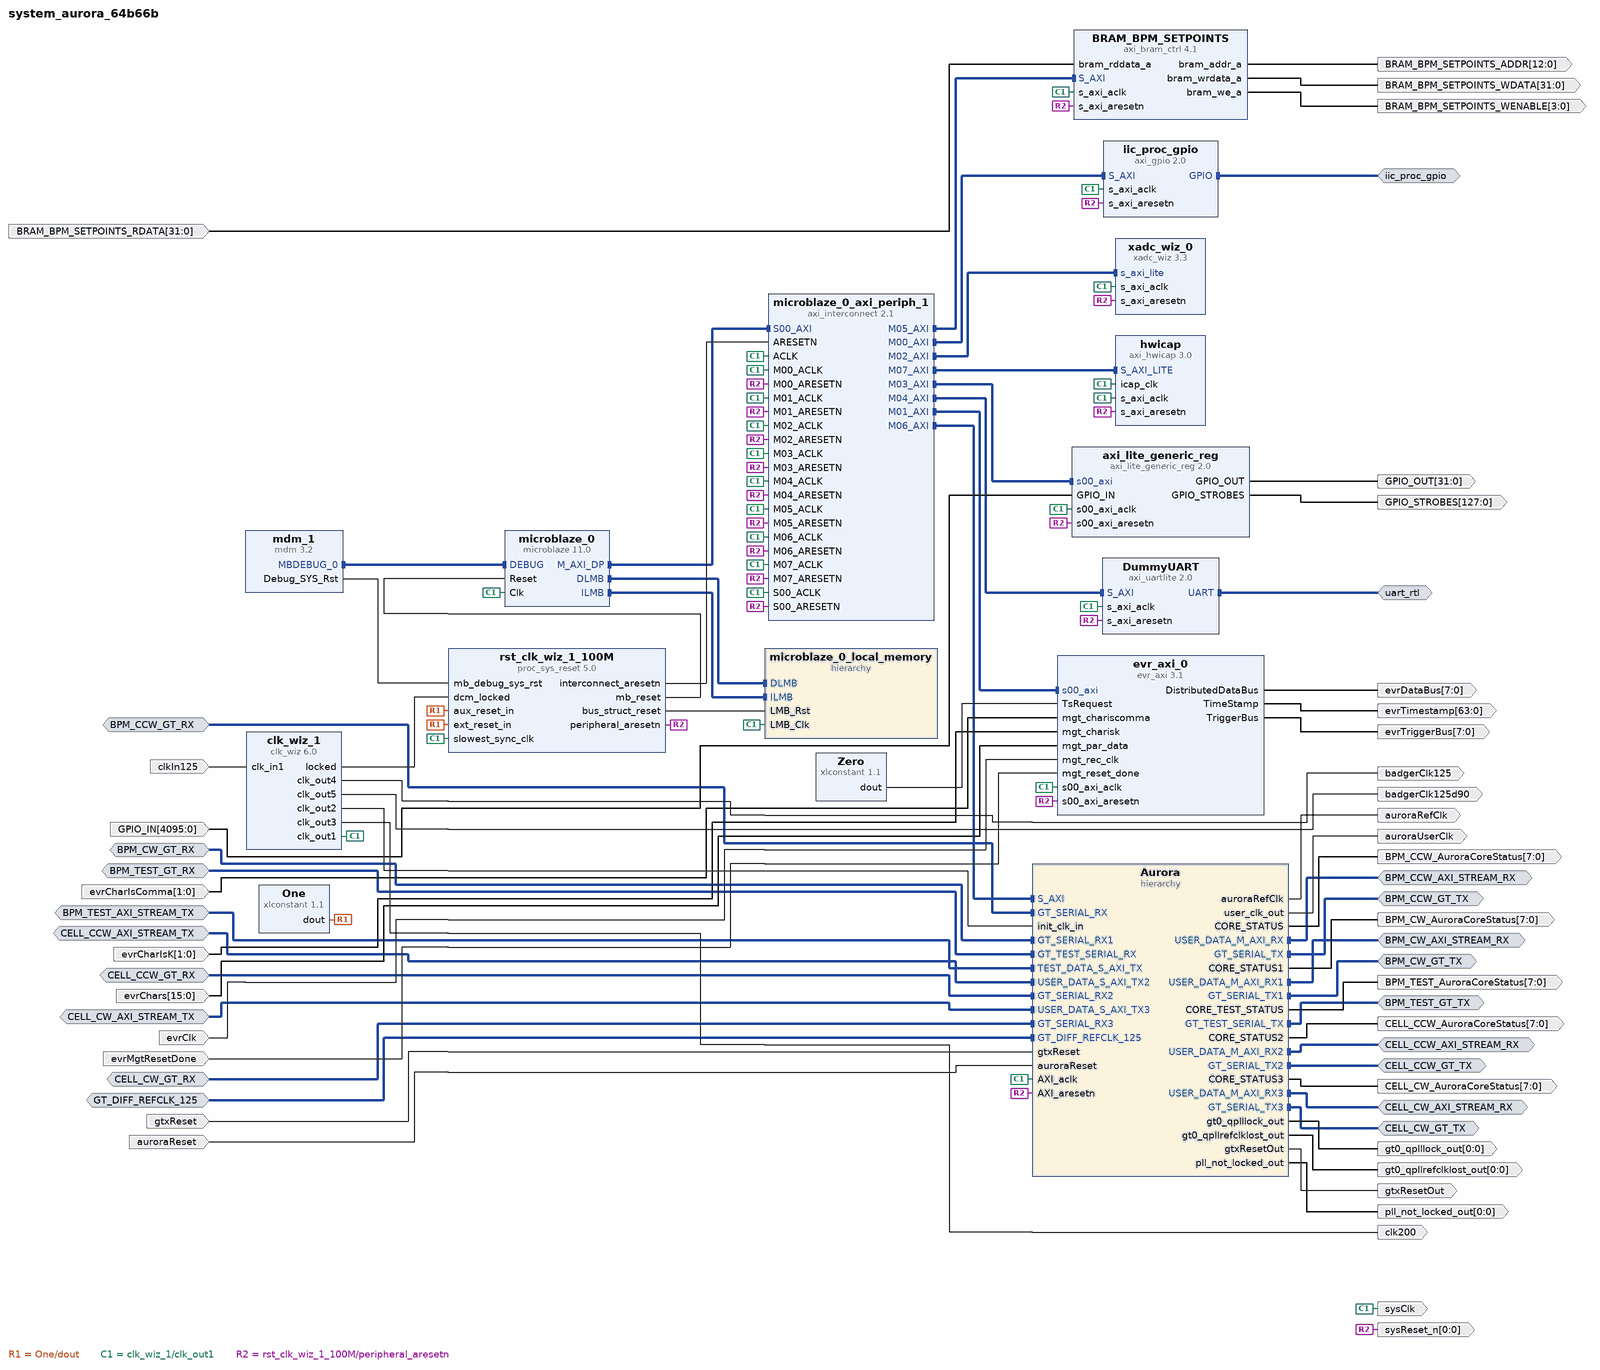
[diagram p0: block diagram of the top level]
# Vivado block design system_aurora_64b66b, xc7k160tffg676-2, Vivado 2022.1
create_bd_design system_aurora_64b66b

create_bd_intf_port -mode Slave -vlnv xilinx.com:display_aurora:GT_Serial_Transceiver_Pins_RX_rtl:1.0 BPM_CW_GT_RX
create_bd_intf_port -mode Master -vlnv xilinx.com:display_aurora:GT_Serial_Transceiver_Pins_TX_rtl:1.0 BPM_CW_GT_TX
create_bd_intf_port -mode Master -vlnv xilinx.com:display_aurora:GT_Serial_Transceiver_Pins_TX_rtl:1.0 BPM_CCW_GT_TX
create_bd_intf_port -mode Slave -vlnv xilinx.com:display_aurora:GT_Serial_Transceiver_Pins_RX_rtl:1.0 BPM_CCW_GT_RX
create_bd_intf_port -mode Slave -vlnv xilinx.com:display_aurora:GT_Serial_Transceiver_Pins_RX_rtl:1.0 CELL_CCW_GT_RX
create_bd_intf_port -mode Slave -vlnv xilinx.com:display_aurora:GT_Serial_Transceiver_Pins_RX_rtl:1.0 CELL_CW_GT_RX
create_bd_intf_port -mode Slave -vlnv xilinx.com:interface:axis_rtl:1.0 CELL_CCW_AXI_STREAM_TX
set_property -dict [list \
  CONFIG.HAS_TKEEP 0 \
  CONFIG.HAS_TLAST 0 \
  CONFIG.HAS_TREADY 1 \
  CONFIG.HAS_TSTRB 0 \
  CONFIG.LAYERED_METADATA undef \
  CONFIG.TDATA_NUM_BYTES 4 \
  CONFIG.TDEST_WIDTH 0 \
  CONFIG.TID_WIDTH 0 \
  CONFIG.TUSER_WIDTH 0 \
] [get_bd_intf_ports CELL_CCW_AXI_STREAM_TX]
create_bd_intf_port -mode Slave -vlnv xilinx.com:interface:axis_rtl:1.0 CELL_CW_AXI_STREAM_TX
set_property -dict [list \
  CONFIG.HAS_TKEEP 0 \
  CONFIG.HAS_TLAST 0 \
  CONFIG.HAS_TREADY 1 \
  CONFIG.HAS_TSTRB 0 \
  CONFIG.LAYERED_METADATA undef \
  CONFIG.TDATA_NUM_BYTES 4 \
  CONFIG.TDEST_WIDTH 0 \
  CONFIG.TID_WIDTH 0 \
  CONFIG.TUSER_WIDTH 0 \
] [get_bd_intf_ports CELL_CW_AXI_STREAM_TX]
create_bd_intf_port -mode Master -vlnv xilinx.com:display_aurora:GT_Serial_Transceiver_Pins_TX_rtl:1.0 CELL_CCW_GT_TX
create_bd_intf_port -mode Master -vlnv xilinx.com:display_aurora:GT_Serial_Transceiver_Pins_TX_rtl:1.0 CELL_CW_GT_TX
create_bd_intf_port -mode Master -vlnv xilinx.com:interface:axis_rtl:1.0 BPM_CW_AXI_STREAM_RX
create_bd_intf_port -mode Master -vlnv xilinx.com:interface:axis_rtl:1.0 CELL_CCW_AXI_STREAM_RX
create_bd_intf_port -mode Master -vlnv xilinx.com:interface:axis_rtl:1.0 CELL_CW_AXI_STREAM_RX
create_bd_intf_port -mode Master -vlnv xilinx.com:interface:axis_rtl:1.0 BPM_CCW_AXI_STREAM_RX
create_bd_intf_port -mode Master -vlnv xilinx.com:interface:uart_rtl:1.0 uart_rtl
create_bd_intf_port -mode Slave -vlnv xilinx.com:interface:diff_clock_rtl:1.0 GT_DIFF_REFCLK_125
set_property -dict {CONFIG.FREQ_HZ 125000000} [get_bd_intf_ports GT_DIFF_REFCLK_125]
create_bd_intf_port -mode Master -vlnv xilinx.com:interface:gpio_rtl:1.0 iic_proc_gpio
create_bd_intf_port -mode Slave -vlnv xilinx.com:interface:axis_rtl:1.0 BPM_TEST_AXI_STREAM_TX
set_property -dict [list \
  CONFIG.HAS_TKEEP 0 \
  CONFIG.HAS_TLAST 0 \
  CONFIG.HAS_TREADY 1 \
  CONFIG.HAS_TSTRB 0 \
  CONFIG.LAYERED_METADATA undef \
  CONFIG.TDATA_NUM_BYTES 4 \
  CONFIG.TDEST_WIDTH 0 \
  CONFIG.TID_WIDTH 0 \
  CONFIG.TUSER_WIDTH 0 \
] [get_bd_intf_ports BPM_TEST_AXI_STREAM_TX]
create_bd_intf_port -mode Master -vlnv xilinx.com:display_aurora:GT_Serial_Transceiver_Pins_TX_rtl:1.0 BPM_TEST_GT_TX
create_bd_intf_port -mode Slave -vlnv xilinx.com:display_aurora:GT_Serial_Transceiver_Pins_RX_rtl:1.0 BPM_TEST_GT_RX
create_bd_port -dir O -type clk sysClk
create_bd_port -dir O -from 0 -to 0 sysReset_n
create_bd_port -dir I -type clk clkIn125
set_property -dict {CONFIG.FREQ_HZ 125000000 CONFIG.PHASE 0.000} [get_bd_ports clkIn125]
create_bd_port -dir O -type clk auroraUserClk
set_property -dict [list \
  CONFIG.ASSOCIATED_BUSIF BPM_CCW_AXI_STREAM_RX:BPM_CW_AXI_STREAM_RX:CELL_CCW_AXI_STREAM_RX:CELL_CW_AXI_STREAM_RX:CELL_CCW_AXI_STREAM_TX:CELL_CW_AXI_STREAM_TX:BPM_TEST_AXI_STREAM_TX \
  CONFIG.ASSOCIATED_RESET auroraReset_CELL_CCW:auroraReset_BPM_CW:gtxReset_BPM_CW:auroraReset_CELL_CW:gtxReset_CELL_CW:auroraReset:auroraReset_AXI:gtxReset:gtxReset_CELL_CCW \
] [get_bd_ports auroraUserClk]
create_bd_port -dir O -from 0 -to 0 gt0_qpllrefclklost_out
create_bd_port -dir O -from 0 -to 0 gt0_qplllock_out
create_bd_port -dir O -from 0 -to 0 pll_not_locked_out
create_bd_port -dir O -from 7 -to 0 evrTriggerBus
create_bd_port -dir O -from 12 -to 0 BRAM_BPM_SETPOINTS_ADDR
create_bd_port -dir O -from 31 -to 0 BRAM_BPM_SETPOINTS_WDATA
create_bd_port -dir O -from 3 -to 0 BRAM_BPM_SETPOINTS_WENABLE
create_bd_port -dir I -from 31 -to 0 BRAM_BPM_SETPOINTS_RDATA
create_bd_port -dir O clk200
create_bd_port -dir O -from 7 -to 0 evrDataBus
create_bd_port -dir I evrClk
create_bd_port -dir I -from 15 -to 0 evrChars
create_bd_port -dir I -from 1 -to 0 evrCharIsComma
create_bd_port -dir I -from 1 -to 0 evrCharIsK
create_bd_port -dir I evrMgtResetDone
create_bd_port -dir O -from 63 -to 0 evrTimestamp
create_bd_port -dir I -type rst auroraReset
set_property -dict {CONFIG.POLARITY ACTIVE_HIGH} [get_bd_ports auroraReset]
create_bd_port -dir I -type rst gtxReset
set_property -dict {CONFIG.POLARITY ACTIVE_HIGH} [get_bd_ports gtxReset]
create_bd_port -dir O -type rst gtxResetOut
create_bd_port -dir O -type clk auroraRefClk
create_bd_port -dir O -from 127 -to 0 GPIO_STROBES
create_bd_port -dir O -from 31 -to 0 GPIO_OUT
create_bd_port -dir I -from 4095 -to 0 GPIO_IN
create_bd_port -dir O -type clk badgerClk125
create_bd_port -dir O -type clk badgerClk125d90
create_bd_port -dir O -from 7 -to 0 BPM_CCW_AuroraCoreStatus
create_bd_port -dir O -from 7 -to 0 BPM_CW_AuroraCoreStatus
create_bd_port -dir O -from 7 -to 0 CELL_CCW_AuroraCoreStatus
create_bd_port -dir O -from 7 -to 0 CELL_CW_AuroraCoreStatus
create_bd_port -dir O -from 7 -to 0 BPM_TEST_AuroraCoreStatus

create_bd_cell -type hier microblaze_0_local_memory
create_bd_cell -type hier Aurora
create_bd_cell -type ip -vlnv xilinx.com:ip:proc_sys_reset:5.0 rst_clk_wiz_1_100M
create_bd_cell -type ip -vlnv xilinx.com:ip:axi_bram_ctrl:4.1 BRAM_BPM_SETPOINTS
set_property -dict {CONFIG.PROTOCOL AXI4LITE CONFIG.SINGLE_PORT_BRAM 1} [get_bd_cells BRAM_BPM_SETPOINTS]
create_bd_cell -type ip -vlnv xilinx.com:ip:axi_uartlite:2.0 DummyUART
create_bd_cell -type ip -vlnv xilinx.com:ip:clk_wiz:6.0 clk_wiz_1
set_property -dict [list \
  CONFIG.CLKIN1_JITTER_PS 80.0 \
  CONFIG.CLKOUT1_JITTER 124.615 \
  CONFIG.CLKOUT1_PHASE_ERROR 96.948 \
  CONFIG.CLKOUT2_JITTER 143.688 \
  CONFIG.CLKOUT2_PHASE_ERROR 96.948 \
  CONFIG.CLKOUT2_REQUESTED_OUT_FREQ 50 \
  CONFIG.CLKOUT2_USED true \
  CONFIG.CLKOUT3_JITTER 109.241 \
  CONFIG.CLKOUT3_PHASE_ERROR 96.948 \
  CONFIG.CLKOUT3_REQUESTED_OUT_FREQ 200 \
  CONFIG.CLKOUT3_USED true \
  CONFIG.CLKOUT4_JITTER 119.348 \
  CONFIG.CLKOUT4_PHASE_ERROR 96.948 \
  CONFIG.CLKOUT4_REQUESTED_OUT_FREQ 125.000 \
  CONFIG.CLKOUT4_USED true \
  CONFIG.CLKOUT5_JITTER 119.348 \
  CONFIG.CLKOUT5_PHASE_ERROR 96.948 \
  CONFIG.CLKOUT5_REQUESTED_OUT_FREQ 125.000 \
  CONFIG.CLKOUT5_REQUESTED_PHASE 90.000 \
  CONFIG.CLKOUT5_USED true \
  CONFIG.CLKOUT6_JITTER 154.207 \
  CONFIG.CLKOUT6_PHASE_ERROR 164.985 \
  CONFIG.CLKOUT6_REQUESTED_OUT_FREQ 100.000 \
  CONFIG.CLKOUT6_USED false \
  CONFIG.MMCM_CLKFBOUT_MULT_F 8.000 \
  CONFIG.MMCM_CLKIN1_PERIOD 8.000 \
  CONFIG.MMCM_CLKIN2_PERIOD 10.000 \
  CONFIG.MMCM_CLKOUT0_DIVIDE_F 10.000 \
  CONFIG.MMCM_CLKOUT1_DIVIDE 20 \
  CONFIG.MMCM_CLKOUT2_DIVIDE 5 \
  CONFIG.MMCM_CLKOUT3_DIVIDE 8 \
  CONFIG.MMCM_CLKOUT4_DIVIDE 8 \
  CONFIG.MMCM_CLKOUT4_PHASE 90.000 \
  CONFIG.MMCM_CLKOUT5_DIVIDE 1 \
  CONFIG.MMCM_DIVCLK_DIVIDE 1 \
  CONFIG.NUM_OUT_CLKS 5 \
  CONFIG.PRIM_IN_FREQ 125.000 \
  CONFIG.PRIM_SOURCE Global_buffer \
  CONFIG.USE_RESET false \
] [get_bd_cells clk_wiz_1]
create_bd_cell -type ip -vlnv xilinx.com:ip:mdm:3.2 mdm_1
create_bd_cell -type ip -vlnv xilinx.com:ip:microblaze:11.0 microblaze_0
set_property -dict [list \
  CONFIG.C_ADDR_TAG_BITS 0 \
  CONFIG.C_DCACHE_ADDR_TAG 0 \
  CONFIG.C_DEBUG_ENABLED 1 \
  CONFIG.C_D_AXI 1 \
  CONFIG.C_D_LMB 1 \
  CONFIG.C_I_LMB 1 \
  CONFIG.C_USE_BARREL 1 \
  CONFIG.C_USE_BRANCH_TARGET_CACHE 1 \
  CONFIG.C_USE_DCACHE 0 \
  CONFIG.C_USE_DIV 1 \
  CONFIG.C_USE_FPU 0 \
  CONFIG.C_USE_HW_MUL 1 \
  CONFIG.C_USE_ICACHE 0 \
] [get_bd_cells microblaze_0]
create_bd_cell -type ip -vlnv xilinx.com:ip:axi_interconnect:2.1 microblaze_0_axi_periph_1
set_property -dict {CONFIG.NUM_MI 8 CONFIG.SYNCHRONIZATION_STAGES 2} [get_bd_cells microblaze_0_axi_periph_1]
create_bd_cell -type ip -vlnv xilinx.com:ip:xadc_wiz:3.3 xadc_wiz_0
set_property -dict [list \
  CONFIG.ADC_CONVERSION_RATE 500 \
  CONFIG.ADC_OFFSET_AND_GAIN_CALIBRATION true \
  CONFIG.ADC_OFFSET_CALIBRATION true \
  CONFIG.AVERAGE_ENABLE_TEMPERATURE true \
  CONFIG.AVERAGE_ENABLE_VBRAM true \
  CONFIG.AVERAGE_ENABLE_VCCAUX true \
  CONFIG.AVERAGE_ENABLE_VCCINT true \
  CONFIG.CHANNEL_AVERAGING 16 \
  CONFIG.CHANNEL_ENABLE_CALIBRATION true \
  CONFIG.CHANNEL_ENABLE_TEMPERATURE true \
  CONFIG.CHANNEL_ENABLE_VBRAM true \
  CONFIG.CHANNEL_ENABLE_VCCAUX true \
  CONFIG.CHANNEL_ENABLE_VCCINT true \
  CONFIG.CHANNEL_ENABLE_VP_VN false \
  CONFIG.ENABLE_RESET false \
  CONFIG.ENABLE_TEMP_BUS false \
  CONFIG.INTERFACE_SELECTION Enable_AXI \
  CONFIG.OT_ALARM false \
  CONFIG.POWER_DOWN_ADCB true \
  CONFIG.SEQUENCER_MODE Continuous \
  CONFIG.USER_TEMP_ALARM false \
  CONFIG.VCCAUX_ALARM false \
  CONFIG.VCCINT_ALARM false \
  CONFIG.XADC_STARUP_SELECTION channel_sequencer \
] [get_bd_cells xadc_wiz_0]
create_bd_cell -type ip -vlnv xilinx.com:ip:xlconstant:1.1 One
set_property -dict {CONFIG.CONST_VAL 1} [get_bd_cells One]
create_bd_cell -type ip -vlnv xilinx.com:ip:xlconstant:1.1 Zero
set_property -dict {CONFIG.CONST_VAL 0} [get_bd_cells Zero]
create_bd_cell -type ip -vlnv lbl.gov:user:axi_lite_generic_reg:2.0 axi_lite_generic_reg
set_property -dict {CONFIG.C_S00_AXI_ADDR_WIDTH 9} [get_bd_cells axi_lite_generic_reg]
create_bd_cell -type ip -vlnv xilinx.com:ip:axi_gpio:2.0 iic_proc_gpio
set_property -dict {CONFIG.C_GPIO_WIDTH 4} [get_bd_cells iic_proc_gpio]
create_bd_cell -type ip -vlnv lbl.gov:user:evr_axi:3.1 evr_axi_0
set_property -dict {CONFIG.C_S00_AXI_ADDR_WIDTH 15 CONFIG.C_S00_AXI_ID_WIDTH 12} [get_bd_cells evr_axi_0]
create_bd_cell -type ip -vlnv xilinx.com:ip:axi_hwicap:3.0 hwicap

# ---- hierarchy /microblaze_0_local_memory ----
current_bd_instance /microblaze_0_local_memory
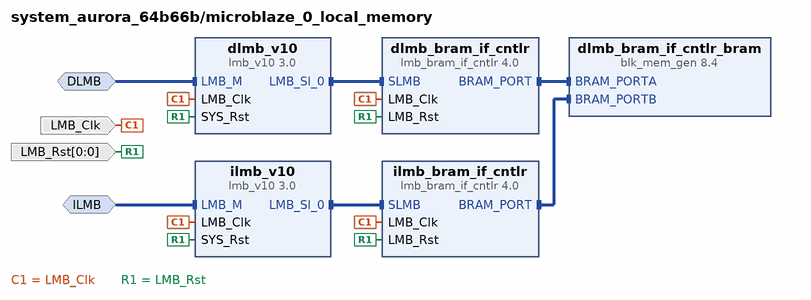
[diagram p1: block diagram inside /microblaze_0_local_memory]
create_bd_intf_pin -mode MirroredMaster -vlnv xilinx.com:interface:lmb_rtl:1.0 DLMB
create_bd_intf_pin -mode MirroredMaster -vlnv xilinx.com:interface:lmb_rtl:1.0 ILMB
create_bd_pin -dir I -type clk LMB_Clk
create_bd_pin -dir I -from 0 -to 0 -type rst LMB_Rst

create_bd_cell -type ip -vlnv xilinx.com:ip:lmb_v10:3.0 dlmb_v10
create_bd_cell -type ip -vlnv xilinx.com:ip:lmb_v10:3.0 ilmb_v10
create_bd_cell -type ip -vlnv xilinx.com:ip:lmb_bram_if_cntlr:4.0 dlmb_bram_if_cntlr
set_property -dict {CONFIG.C_ECC 0} [get_bd_cells dlmb_bram_if_cntlr]
create_bd_cell -type ip -vlnv xilinx.com:ip:blk_mem_gen:8.4 dlmb_bram_if_cntlr_bram
set_property -dict [list \
  CONFIG.EN_SAFETY_CKT false \
  CONFIG.Enable_B Use_ENB_Pin \
  CONFIG.Memory_Type True_Dual_Port_RAM \
  CONFIG.Port_B_Clock 100 \
  CONFIG.Port_B_Enable_Rate 100 \
  CONFIG.Port_B_Write_Rate 50 \
  CONFIG.Use_RSTB_Pin true \
] [get_bd_cells dlmb_bram_if_cntlr_bram]
create_bd_cell -type ip -vlnv xilinx.com:ip:lmb_bram_if_cntlr:4.0 ilmb_bram_if_cntlr
set_property -dict {CONFIG.C_ECC 0} [get_bd_cells ilmb_bram_if_cntlr]

# ---- hierarchy /Aurora ----
current_bd_instance /Aurora
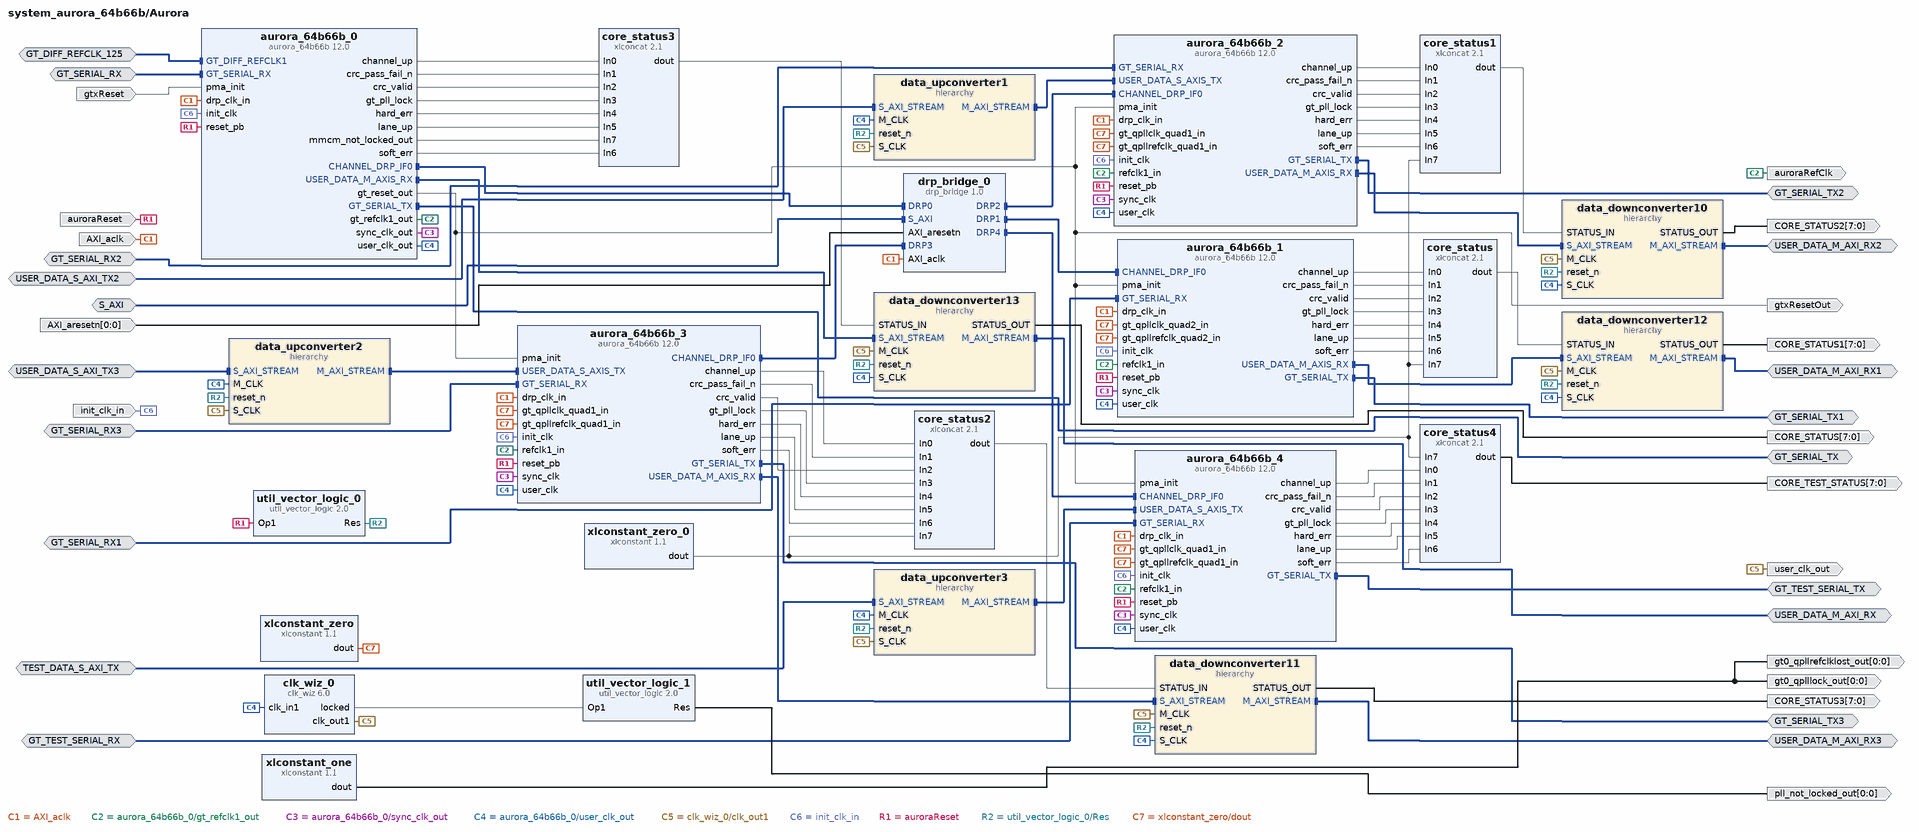
[diagram p2: block diagram inside /Aurora]
create_bd_intf_pin -mode Slave -vlnv xilinx.com:display_aurora:GT_Serial_Transceiver_Pins_RX_rtl:1.0 GT_SERIAL_RX
create_bd_intf_pin -mode Slave -vlnv xilinx.com:interface:diff_clock_rtl:1.0 GT_DIFF_REFCLK_125
create_bd_intf_pin -mode Slave -vlnv xilinx.com:display_aurora:GT_Serial_Transceiver_Pins_RX_rtl:1.0 GT_SERIAL_RX1
create_bd_intf_pin -mode Slave -vlnv xilinx.com:display_aurora:GT_Serial_Transceiver_Pins_RX_rtl:1.0 GT_SERIAL_RX2
create_bd_intf_pin -mode Slave -vlnv xilinx.com:display_aurora:GT_Serial_Transceiver_Pins_RX_rtl:1.0 GT_SERIAL_RX3
create_bd_intf_pin -mode Slave -vlnv xilinx.com:interface:axis_rtl:1.0 USER_DATA_S_AXI_TX2
create_bd_intf_pin -mode Slave -vlnv xilinx.com:interface:axis_rtl:1.0 USER_DATA_S_AXI_TX3
create_bd_intf_pin -mode Master -vlnv xilinx.com:display_aurora:GT_Serial_Transceiver_Pins_TX_rtl:1.0 GT_SERIAL_TX
create_bd_intf_pin -mode Master -vlnv xilinx.com:display_aurora:GT_Serial_Transceiver_Pins_TX_rtl:1.0 GT_SERIAL_TX1
create_bd_intf_pin -mode Master -vlnv xilinx.com:display_aurora:GT_Serial_Transceiver_Pins_TX_rtl:1.0 GT_SERIAL_TX2
create_bd_intf_pin -mode Master -vlnv xilinx.com:display_aurora:GT_Serial_Transceiver_Pins_TX_rtl:1.0 GT_SERIAL_TX3
create_bd_intf_pin -mode Master -vlnv xilinx.com:interface:axis_rtl:1.0 USER_DATA_M_AXI_RX1
create_bd_intf_pin -mode Master -vlnv xilinx.com:interface:axis_rtl:1.0 USER_DATA_M_AXI_RX2
create_bd_intf_pin -mode Master -vlnv xilinx.com:interface:axis_rtl:1.0 USER_DATA_M_AXI_RX3
create_bd_intf_pin -mode Master -vlnv xilinx.com:interface:axis_rtl:1.0 USER_DATA_M_AXI_RX
create_bd_intf_pin -mode Slave -vlnv xilinx.com:interface:aximm_rtl:1.0 S_AXI
create_bd_intf_pin -mode Slave -vlnv xilinx.com:interface:axis_rtl:1.0 TEST_DATA_S_AXI_TX
create_bd_intf_pin -mode Slave -vlnv xilinx.com:display_aurora:GT_Serial_Transceiver_Pins_RX_rtl:1.0 GT_TEST_SERIAL_RX
create_bd_intf_pin -mode Master -vlnv xilinx.com:display_aurora:GT_Serial_Transceiver_Pins_TX_rtl:1.0 GT_TEST_SERIAL_TX
create_bd_pin -dir I -type clk init_clk_in
create_bd_pin -dir O -type clk user_clk_out
create_bd_pin -dir O -from 0 -to 0 gt0_qplllock_out
create_bd_pin -dir O -from 0 -to 0 gt0_qpllrefclklost_out
create_bd_pin -dir O -from 0 -to 0 pll_not_locked_out
create_bd_pin -dir I -type clk AXI_aclk
create_bd_pin -dir I -from 0 -to 0 -type rst AXI_aresetn
create_bd_pin -dir I -type rst auroraReset
create_bd_pin -dir I -type rst gtxReset
create_bd_pin -dir O -type rst gtxResetOut
create_bd_pin -dir O -type clk auroraRefClk
create_bd_pin -dir O -from 7 -to 0 CORE_STATUS1
create_bd_pin -dir O -from 7 -to 0 CORE_STATUS2
create_bd_pin -dir O -from 7 -to 0 CORE_STATUS3
create_bd_pin -dir O -from 7 -to 0 CORE_STATUS
create_bd_pin -dir O -from 7 -to 0 CORE_TEST_STATUS

create_bd_cell -type ip -vlnv xilinx.com:ip:util_vector_logic:2.0 util_vector_logic_0
set_property -dict {CONFIG.C_OPERATION not CONFIG.C_SIZE 1} [get_bd_cells util_vector_logic_0]
create_bd_cell -type ip -vlnv xilinx.com:user:drp_bridge:1.0 drp_bridge_0
set_property -dict {CONFIG.DRP_COUNT 5} [get_bd_cells drp_bridge_0]
create_bd_cell -type ip -vlnv xilinx.com:ip:aurora_64b66b:12.0 aurora_64b66b_0
set_property -dict [list \
  CONFIG.C_GT_CLOCK_1 GTXQ1 \
  CONFIG.C_GT_LOC_1 X \
  CONFIG.C_GT_LOC_8 1 \
  CONFIG.C_REFCLK_FREQUENCY 125.000 \
  CONFIG.SINGLEEND_GTREFCLK false \
  CONFIG.SINGLEEND_INITCLK true \
  CONFIG.SupportLevel 1 \
  CONFIG.crc_mode true \
  CONFIG.drp_mode Native \
] [get_bd_cells aurora_64b66b_0]
create_bd_cell -type ip -vlnv xilinx.com:ip:clk_wiz:6.0 clk_wiz_0
set_property -dict [list \
  CONFIG.CLKIN1_JITTER_PS 204.8 \
  CONFIG.CLKOUT1_DRIVES BUFG \
  CONFIG.CLKOUT1_JITTER 181.092 \
  CONFIG.CLKOUT1_PHASE_ERROR 165.531 \
  CONFIG.CLKOUT1_REQUESTED_OUT_FREQ 97.65625 \
  CONFIG.CLKOUT2_DRIVES BUFG \
  CONFIG.CLKOUT2_JITTER 189.047 \
  CONFIG.CLKOUT2_PHASE_ERROR 170.782 \
  CONFIG.CLKOUT2_REQUESTED_OUT_FREQ 100.000 \
  CONFIG.CLKOUT2_USED false \
  CONFIG.CLKOUT3_DRIVES BUFG \
  CONFIG.CLKOUT4_DRIVES BUFG \
  CONFIG.CLKOUT5_DRIVES BUFG \
  CONFIG.CLKOUT6_DRIVES BUFG \
  CONFIG.CLKOUT7_DRIVES BUFG \
  CONFIG.MMCM_BANDWIDTH OPTIMIZED \
  CONFIG.MMCM_CLKFBOUT_MULT_F 18 \
  CONFIG.MMCM_CLKIN1_PERIOD 20.480 \
  CONFIG.MMCM_CLKIN2_PERIOD 10.000 \
  CONFIG.MMCM_CLKOUT0_DIVIDE_F 9 \
  CONFIG.MMCM_CLKOUT1_DIVIDE 1 \
  CONFIG.MMCM_COMPENSATION ZHOLD \
  CONFIG.NUM_OUT_CLKS 1 \
  CONFIG.PLL_CLKIN_PERIOD 20.480 \
  CONFIG.PRIMITIVE PLL \
  CONFIG.PRIM_IN_FREQ 48.828125 \
  CONFIG.USE_RESET false \
] [get_bd_cells clk_wiz_0]
create_bd_cell -type ip -vlnv xilinx.com:ip:aurora_64b66b:12.0 aurora_64b66b_3
set_property -dict [list \
  CONFIG.C_GT_CLOCK_1 GTXQ0 \
  CONFIG.C_GT_LOC_1 X \
  CONFIG.C_GT_LOC_4 1 \
  CONFIG.C_REFCLK_FREQUENCY 125.000 \
  CONFIG.crc_mode true \
  CONFIG.drp_mode Native \
] [get_bd_cells aurora_64b66b_3]
create_bd_cell -type ip -vlnv xilinx.com:ip:util_vector_logic:2.0 util_vector_logic_1
set_property -dict {CONFIG.C_OPERATION not CONFIG.C_SIZE 1} [get_bd_cells util_vector_logic_1]
create_bd_cell -type ip -vlnv xilinx.com:ip:aurora_64b66b:12.0 aurora_64b66b_4
set_property -dict [list \
  CONFIG.C_GT_CLOCK_1 GTXQ0 \
  CONFIG.C_GT_LOC_1 X \
  CONFIG.C_GT_LOC_4 1 \
  CONFIG.C_REFCLK_FREQUENCY 125.000 \
  CONFIG.crc_mode true \
  CONFIG.drp_mode Native \
] [get_bd_cells aurora_64b66b_4]
create_bd_cell -type ip -vlnv xilinx.com:ip:aurora_64b66b:12.0 aurora_64b66b_2
set_property -dict [list \
  CONFIG.C_GT_CLOCK_1 GTXQ0 \
  CONFIG.C_GT_LOC_1 X \
  CONFIG.C_GT_LOC_3 1 \
  CONFIG.C_GT_LOC_4 X \
  CONFIG.C_REFCLK_FREQUENCY 125.000 \
  CONFIG.crc_mode true \
  CONFIG.drp_mode Native \
] [get_bd_cells aurora_64b66b_2]
create_bd_cell -type ip -vlnv xilinx.com:ip:aurora_64b66b:12.0 aurora_64b66b_1
set_property -dict [list \
  CONFIG.C_GT_CLOCK_1 GTXQ1 \
  CONFIG.C_GT_LOC_1 X \
  CONFIG.C_GT_LOC_3 X \
  CONFIG.C_GT_LOC_4 X \
  CONFIG.C_GT_LOC_6 1 \
  CONFIG.C_REFCLK_FREQUENCY 125.000 \
  CONFIG.crc_mode true \
  CONFIG.drp_mode Native \
] [get_bd_cells aurora_64b66b_1]
create_bd_cell -type ip -vlnv xilinx.com:ip:xlconstant:1.1 xlconstant_one
create_bd_cell -type ip -vlnv xilinx.com:ip:xlconstant:1.1 xlconstant_zero
set_property -dict {CONFIG.CONST_VAL 0} [get_bd_cells xlconstant_zero]
create_bd_cell -type hier data_upconverter1
create_bd_cell -type hier data_upconverter2
create_bd_cell -type hier data_upconverter3
create_bd_cell -type ip -vlnv xilinx.com:ip:xlconcat:2.1 core_status
set_property -dict {CONFIG.NUM_PORTS 8} [get_bd_cells core_status]
create_bd_cell -type ip -vlnv xilinx.com:ip:xlconstant:1.1 xlconstant_zero_0
set_property -dict {CONFIG.CONST_VAL 0} [get_bd_cells xlconstant_zero_0]
create_bd_cell -type ip -vlnv xilinx.com:ip:xlconcat:2.1 core_status1
set_property -dict {CONFIG.NUM_PORTS 8} [get_bd_cells core_status1]
create_bd_cell -type ip -vlnv xilinx.com:ip:xlconcat:2.1 core_status3
set_property -dict {CONFIG.NUM_PORTS 8} [get_bd_cells core_status3]
create_bd_cell -type ip -vlnv xilinx.com:ip:xlconcat:2.1 core_status4
set_property -dict {CONFIG.NUM_PORTS 8} [get_bd_cells core_status4]
create_bd_cell -type ip -vlnv xilinx.com:ip:xlconcat:2.1 core_status2
set_property -dict {CONFIG.NUM_PORTS 8} [get_bd_cells core_status2]
create_bd_cell -type hier data_downconverter10
create_bd_cell -type hier data_downconverter11
create_bd_cell -type hier data_downconverter12
create_bd_cell -type hier data_downconverter13

# ---- hierarchy /Aurora/data_upconverter1 ----
current_bd_instance /Aurora/data_upconverter1
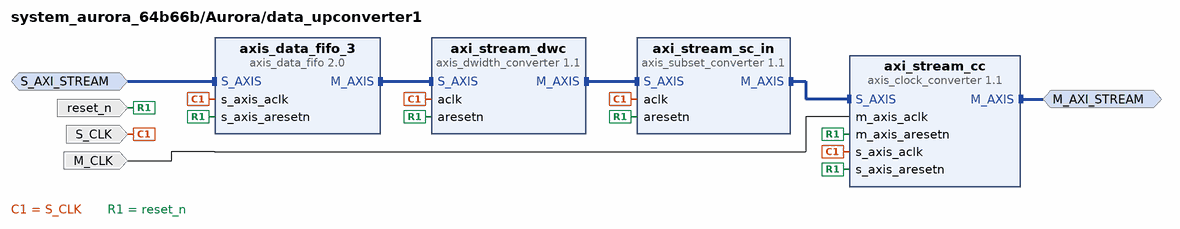
[diagram p3: block diagram inside /Aurora/data_upconverter1]
create_bd_intf_pin -mode Slave -vlnv xilinx.com:interface:axis_rtl:1.0 S_AXI_STREAM
create_bd_intf_pin -mode Master -vlnv xilinx.com:interface:axis_rtl:1.0 M_AXI_STREAM
create_bd_pin -dir I -type clk S_CLK
create_bd_pin -dir I -type clk M_CLK
create_bd_pin -dir I -type rst reset_n

create_bd_cell -type ip -vlnv xilinx.com:ip:axis_data_fifo:2.0 axis_data_fifo_3
set_property -dict [list \
  CONFIG.FIFO_DEPTH 256 \
  CONFIG.FIFO_MODE 1 \
  CONFIG.HAS_TLAST 1 \
  CONFIG.IS_ACLK_ASYNC 0 \
] [get_bd_cells axis_data_fifo_3]
create_bd_cell -type ip -vlnv xilinx.com:ip:axis_dwidth_converter:1.1 axi_stream_dwc
set_property -dict {CONFIG.HAS_MI_TKEEP 1 CONFIG.M_TDATA_NUM_BYTES 8 CONFIG.S_TDATA_NUM_BYTES 4} [get_bd_cells axi_stream_dwc]
create_bd_cell -type ip -vlnv xilinx.com:ip:axis_clock_converter:1.1 axi_stream_cc
create_bd_cell -type ip -vlnv xilinx.com:ip:axis_subset_converter:1.1 axi_stream_sc_in
set_property -dict [list \
  CONFIG.M_HAS_TKEEP 1 \
  CONFIG.M_HAS_TREADY 1 \
  CONFIG.M_TDATA_NUM_BYTES 8 \
  CONFIG.S_HAS_TKEEP 1 \
  CONFIG.S_TDATA_NUM_BYTES 8 \
  CONFIG.TDATA_REMAP {tdata[31:0],tdata[63:32]} \
  CONFIG.TID_REMAP {1'b0} \
  CONFIG.TKEEP_REMAP {tkeep[3:0],tkeep[7:4]} \
  CONFIG.TUSER_REMAP {1'b0} \
] [get_bd_cells axi_stream_sc_in]

# ---- hierarchy /Aurora/data_upconverter2 ----
current_bd_instance /Aurora/data_upconverter2
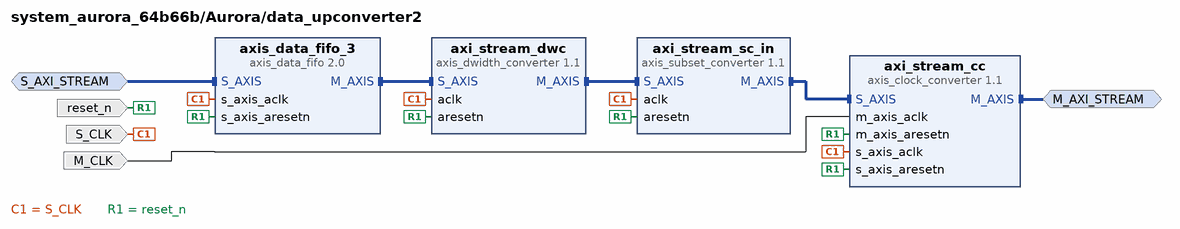
[diagram p4: block diagram inside /Aurora/data_upconverter2]
create_bd_intf_pin -mode Slave -vlnv xilinx.com:interface:axis_rtl:1.0 S_AXI_STREAM
create_bd_intf_pin -mode Master -vlnv xilinx.com:interface:axis_rtl:1.0 M_AXI_STREAM
create_bd_pin -dir I -type clk S_CLK
create_bd_pin -dir I -type clk M_CLK
create_bd_pin -dir I -type rst reset_n

create_bd_cell -type ip -vlnv xilinx.com:ip:axis_data_fifo:2.0 axis_data_fifo_3
set_property -dict [list \
  CONFIG.FIFO_DEPTH 256 \
  CONFIG.FIFO_MODE 1 \
  CONFIG.HAS_TLAST 1 \
  CONFIG.IS_ACLK_ASYNC 0 \
] [get_bd_cells axis_data_fifo_3]
create_bd_cell -type ip -vlnv xilinx.com:ip:axis_dwidth_converter:1.1 axi_stream_dwc
set_property -dict {CONFIG.HAS_MI_TKEEP 1 CONFIG.M_TDATA_NUM_BYTES 8 CONFIG.S_TDATA_NUM_BYTES 4} [get_bd_cells axi_stream_dwc]
create_bd_cell -type ip -vlnv xilinx.com:ip:axis_clock_converter:1.1 axi_stream_cc
create_bd_cell -type ip -vlnv xilinx.com:ip:axis_subset_converter:1.1 axi_stream_sc_in
set_property -dict [list \
  CONFIG.M_HAS_TKEEP 1 \
  CONFIG.M_HAS_TREADY 1 \
  CONFIG.M_TDATA_NUM_BYTES 8 \
  CONFIG.S_HAS_TKEEP 1 \
  CONFIG.S_TDATA_NUM_BYTES 8 \
  CONFIG.TDATA_REMAP {tdata[31:0],tdata[63:32]} \
  CONFIG.TID_REMAP {1'b0} \
  CONFIG.TKEEP_REMAP {tkeep[3:0],tkeep[7:4]} \
  CONFIG.TUSER_REMAP {1'b0} \
] [get_bd_cells axi_stream_sc_in]

# ---- hierarchy /Aurora/data_upconverter3 ----
current_bd_instance /Aurora/data_upconverter3
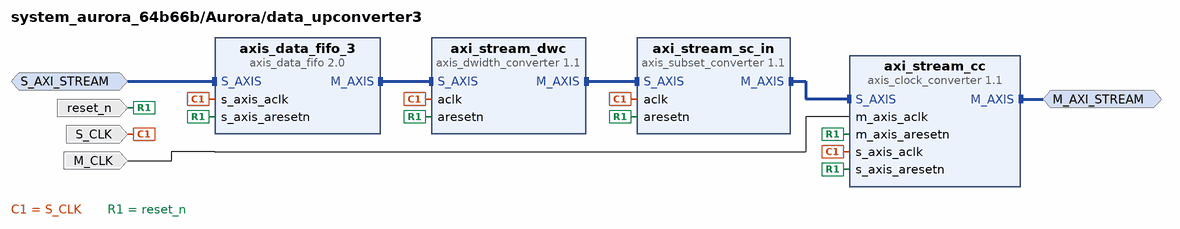
[diagram p5: block diagram inside /Aurora/data_upconverter3]
create_bd_intf_pin -mode Slave -vlnv xilinx.com:interface:axis_rtl:1.0 S_AXI_STREAM
create_bd_intf_pin -mode Master -vlnv xilinx.com:interface:axis_rtl:1.0 M_AXI_STREAM
create_bd_pin -dir I -type clk S_CLK
create_bd_pin -dir I -type clk M_CLK
create_bd_pin -dir I -type rst reset_n

create_bd_cell -type ip -vlnv xilinx.com:ip:axis_data_fifo:2.0 axis_data_fifo_3
set_property -dict [list \
  CONFIG.FIFO_DEPTH 256 \
  CONFIG.FIFO_MODE 1 \
  CONFIG.HAS_TLAST 1 \
  CONFIG.IS_ACLK_ASYNC 0 \
] [get_bd_cells axis_data_fifo_3]
create_bd_cell -type ip -vlnv xilinx.com:ip:axis_dwidth_converter:1.1 axi_stream_dwc
set_property -dict [list \
  CONFIG.M_TDATA_NUM_BYTES 4 \
  CONFIG.S_TDATA_NUM_BYTES 8 \
  CONFIG.TUSER_BITS_PER_BYTE 2 \
] [get_bd_cells axi_stream_dwc]
create_bd_cell -type ip -vlnv xilinx.com:ip:axis_clock_converter:1.1 axi_stream_cc
set_property -dict {CONFIG.TUSER_WIDTH 16} [get_bd_cells axi_stream_cc]
create_bd_cell -type ip -vlnv xilinx.com:ip:axis_subset_converter:1.1 axi_stream_sc_in
set_property -dict [list \
  CONFIG.M_HAS_TKEEP 1 \
  CONFIG.M_HAS_TREADY 1 \
  CONFIG.M_TDATA_NUM_BYTES 8 \
  CONFIG.M_TUSER_WIDTH 16 \
  CONFIG.S_HAS_TKEEP 1 \
  CONFIG.S_TDATA_NUM_BYTES 8 \
  CONFIG.S_TUSER_WIDTH 16 \
  CONFIG.TDATA_REMAP {tdata[31:0],tdata[63:32]} \
  CONFIG.TID_REMAP {1'b0} \
  CONFIG.TKEEP_REMAP {tkeep[3:0],tkeep[7:4]} \
  CONFIG.TUSER_REMAP {tuser[7:0],tuser[15:8]} \
] [get_bd_cells axi_stream_sc_in]

# ---- hierarchy /Aurora/data_downconverter10 ----
current_bd_instance /Aurora/data_downconverter10
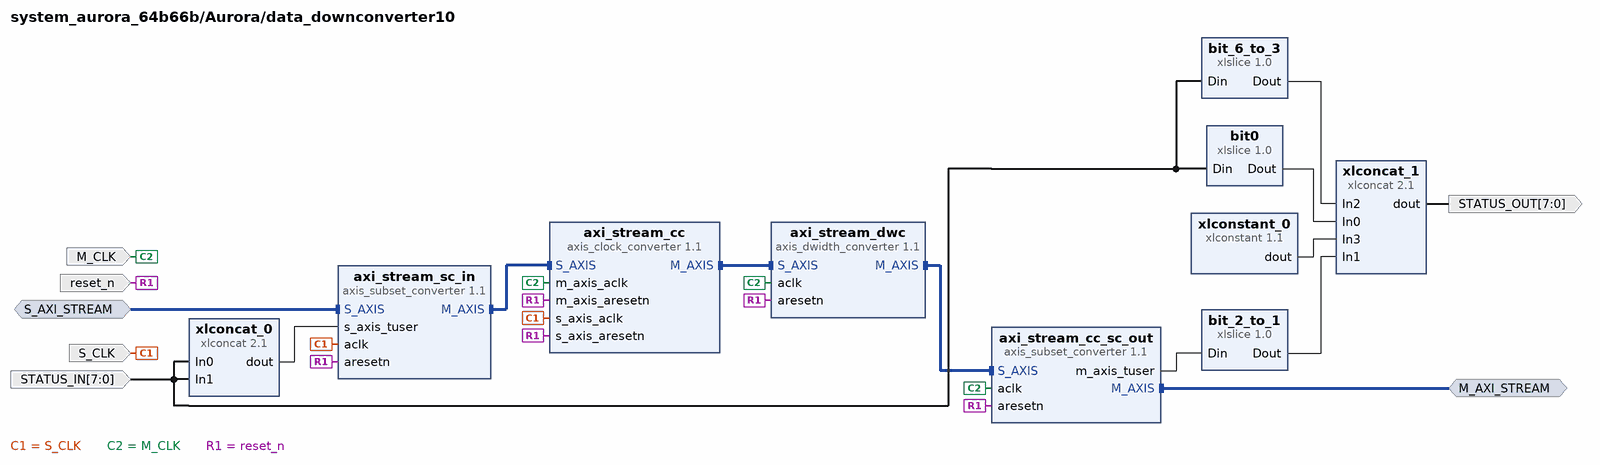
[diagram p6: block diagram inside /Aurora/data_downconverter10]
create_bd_intf_pin -mode Slave -vlnv xilinx.com:interface:axis_rtl:1.0 S_AXI_STREAM
create_bd_intf_pin -mode Master -vlnv xilinx.com:interface:axis_rtl:1.0 M_AXI_STREAM
create_bd_pin -dir I -type clk S_CLK
create_bd_pin -dir I -type clk M_CLK
create_bd_pin -dir I -type rst reset_n
create_bd_pin -dir I -from 7 -to 0 STATUS_IN
create_bd_pin -dir O -from 7 -to 0 STATUS_OUT

create_bd_cell -type ip -vlnv xilinx.com:ip:axis_subset_converter:1.1 axi_stream_sc_in
set_property -dict [list \
  CONFIG.M_HAS_TKEEP 1 \
  CONFIG.M_HAS_TREADY 1 \
  CONFIG.M_TDATA_NUM_BYTES 8 \
  CONFIG.M_TUSER_WIDTH 16 \
  CONFIG.S_HAS_TKEEP 1 \
  CONFIG.S_TDATA_NUM_BYTES 8 \
  CONFIG.S_TUSER_WIDTH 16 \
  CONFIG.TDATA_REMAP {tdata[31:0],tdata[63:32]} \
  CONFIG.TKEEP_REMAP {tkeep[3:0],tkeep[7:4]} \
  CONFIG.TUSER_REMAP {tuser[7:0],tuser[15:8]} \
] [get_bd_cells axi_stream_sc_in]
create_bd_cell -type ip -vlnv xilinx.com:ip:axis_clock_converter:1.1 axi_stream_cc
set_property -dict {CONFIG.TUSER_WIDTH 16} [get_bd_cells axi_stream_cc]
create_bd_cell -type ip -vlnv xilinx.com:ip:axis_dwidth_converter:1.1 axi_stream_dwc
set_property -dict [list \
  CONFIG.M_TDATA_NUM_BYTES 4 \
  CONFIG.S_TDATA_NUM_BYTES 8 \
  CONFIG.TUSER_BITS_PER_BYTE 2 \
] [get_bd_cells axi_stream_dwc]
create_bd_cell -type ip -vlnv xilinx.com:ip:axis_subset_converter:1.1 axi_stream_cc_sc_out
set_property -dict [list \
  CONFIG.M_HAS_TREADY 0 \
  CONFIG.M_TDATA_NUM_BYTES 4 \
  CONFIG.M_TUSER_WIDTH 8 \
  CONFIG.S_TDATA_NUM_BYTES 4 \
  CONFIG.S_TUSER_WIDTH 8 \
  CONFIG.TDATA_REMAP {tdata[31:0]} \
] [get_bd_cells axi_stream_cc_sc_out]
create_bd_cell -type ip -vlnv xilinx.com:ip:xlconcat:2.1 xlconcat_0
create_bd_cell -type ip -vlnv xilinx.com:ip:xlconcat:2.1 xlconcat_1
set_property -dict {CONFIG.NUM_PORTS 4} [get_bd_cells xlconcat_1]
create_bd_cell -type ip -vlnv xilinx.com:ip:xlslice:1.0 bit0
set_property -dict {CONFIG.DIN_WIDTH 8} [get_bd_cells bit0]
create_bd_cell -type ip -vlnv xilinx.com:ip:xlslice:1.0 bit_6_to_3
set_property -dict {CONFIG.DIN_FROM 6 CONFIG.DIN_TO 3 CONFIG.DIN_WIDTH 8 CONFIG.DOUT_WIDTH 4} [get_bd_cells bit_6_to_3]
create_bd_cell -type ip -vlnv xilinx.com:ip:xlslice:1.0 bit_2_to_1
set_property -dict {CONFIG.DIN_FROM 2 CONFIG.DIN_TO 1 CONFIG.DIN_WIDTH 8 CONFIG.DOUT_WIDTH 2} [get_bd_cells bit_2_to_1]
create_bd_cell -type ip -vlnv xilinx.com:ip:xlconstant:1.1 xlconstant_0
set_property -dict {CONFIG.CONST_VAL 0} [get_bd_cells xlconstant_0]

# ---- hierarchy /Aurora/data_downconverter11 ----
current_bd_instance /Aurora/data_downconverter11
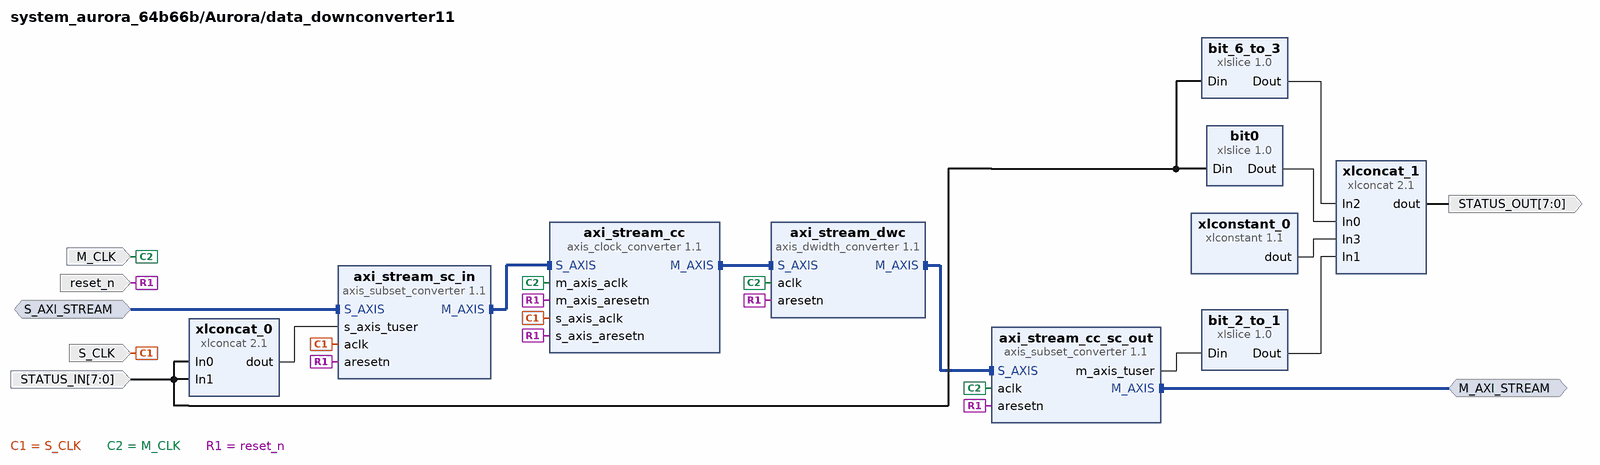
[diagram p7: block diagram inside /Aurora/data_downconverter11]
create_bd_intf_pin -mode Slave -vlnv xilinx.com:interface:axis_rtl:1.0 S_AXI_STREAM
create_bd_intf_pin -mode Master -vlnv xilinx.com:interface:axis_rtl:1.0 M_AXI_STREAM
create_bd_pin -dir I -type clk S_CLK
create_bd_pin -dir I -type clk M_CLK
create_bd_pin -dir I -type rst reset_n
create_bd_pin -dir I -from 7 -to 0 STATUS_IN
create_bd_pin -dir O -from 7 -to 0 STATUS_OUT

create_bd_cell -type ip -vlnv xilinx.com:ip:axis_subset_converter:1.1 axi_stream_sc_in
set_property -dict [list \
  CONFIG.M_HAS_TKEEP 1 \
  CONFIG.M_HAS_TREADY 1 \
  CONFIG.M_TDATA_NUM_BYTES 8 \
  CONFIG.M_TUSER_WIDTH 16 \
  CONFIG.S_HAS_TKEEP 1 \
  CONFIG.S_TDATA_NUM_BYTES 8 \
  CONFIG.S_TUSER_WIDTH 16 \
  CONFIG.TDATA_REMAP {tdata[31:0],tdata[63:32]} \
  CONFIG.TKEEP_REMAP {tkeep[3:0],tkeep[7:4]} \
  CONFIG.TUSER_REMAP {tuser[7:0],tuser[15:8]} \
] [get_bd_cells axi_stream_sc_in]
create_bd_cell -type ip -vlnv xilinx.com:ip:axis_clock_converter:1.1 axi_stream_cc
set_property -dict {CONFIG.TUSER_WIDTH 16} [get_bd_cells axi_stream_cc]
create_bd_cell -type ip -vlnv xilinx.com:ip:axis_dwidth_converter:1.1 axi_stream_dwc
set_property -dict [list \
  CONFIG.M_TDATA_NUM_BYTES 4 \
  CONFIG.S_TDATA_NUM_BYTES 8 \
  CONFIG.TUSER_BITS_PER_BYTE 2 \
] [get_bd_cells axi_stream_dwc]
create_bd_cell -type ip -vlnv xilinx.com:ip:axis_subset_converter:1.1 axi_stream_cc_sc_out
set_property -dict [list \
  CONFIG.M_HAS_TREADY 0 \
  CONFIG.M_TDATA_NUM_BYTES 4 \
  CONFIG.M_TUSER_WIDTH 8 \
  CONFIG.S_TDATA_NUM_BYTES 4 \
  CONFIG.S_TUSER_WIDTH 8 \
  CONFIG.TDATA_REMAP {tdata[31:0]} \
] [get_bd_cells axi_stream_cc_sc_out]
create_bd_cell -type ip -vlnv xilinx.com:ip:xlconcat:2.1 xlconcat_0
create_bd_cell -type ip -vlnv xilinx.com:ip:xlconcat:2.1 xlconcat_1
set_property -dict {CONFIG.NUM_PORTS 4} [get_bd_cells xlconcat_1]
create_bd_cell -type ip -vlnv xilinx.com:ip:xlslice:1.0 bit0
set_property -dict {CONFIG.DIN_WIDTH 8} [get_bd_cells bit0]
create_bd_cell -type ip -vlnv xilinx.com:ip:xlslice:1.0 bit_6_to_3
set_property -dict {CONFIG.DIN_FROM 6 CONFIG.DIN_TO 3 CONFIG.DIN_WIDTH 8 CONFIG.DOUT_WIDTH 4} [get_bd_cells bit_6_to_3]
create_bd_cell -type ip -vlnv xilinx.com:ip:xlslice:1.0 bit_2_to_1
set_property -dict {CONFIG.DIN_FROM 2 CONFIG.DIN_TO 1 CONFIG.DIN_WIDTH 8 CONFIG.DOUT_WIDTH 2} [get_bd_cells bit_2_to_1]
create_bd_cell -type ip -vlnv xilinx.com:ip:xlconstant:1.1 xlconstant_0
set_property -dict {CONFIG.CONST_VAL 0} [get_bd_cells xlconstant_0]

# ---- hierarchy /Aurora/data_downconverter12 ----
current_bd_instance /Aurora/data_downconverter12
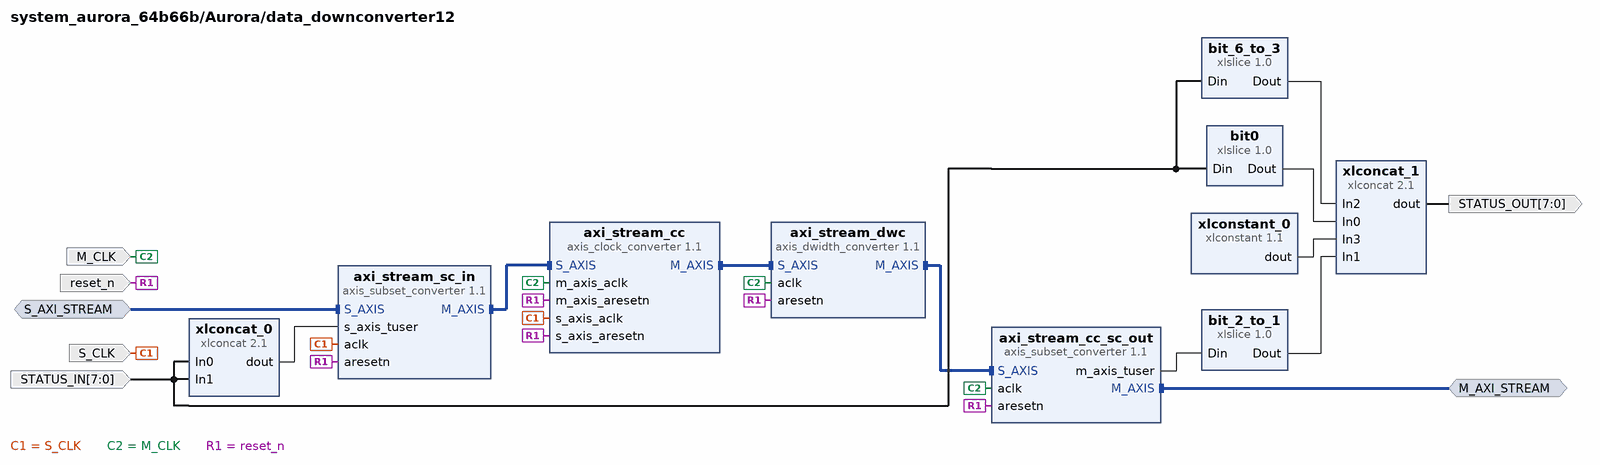
[diagram p8: block diagram inside /Aurora/data_downconverter12]
create_bd_intf_pin -mode Slave -vlnv xilinx.com:interface:axis_rtl:1.0 S_AXI_STREAM
create_bd_intf_pin -mode Master -vlnv xilinx.com:interface:axis_rtl:1.0 M_AXI_STREAM
create_bd_pin -dir I -type clk S_CLK
create_bd_pin -dir I -type clk M_CLK
create_bd_pin -dir I -type rst reset_n
create_bd_pin -dir I -from 7 -to 0 STATUS_IN
create_bd_pin -dir O -from 7 -to 0 STATUS_OUT

create_bd_cell -type ip -vlnv xilinx.com:ip:axis_subset_converter:1.1 axi_stream_sc_in
set_property -dict [list \
  CONFIG.M_HAS_TKEEP 1 \
  CONFIG.M_HAS_TREADY 1 \
  CONFIG.M_TDATA_NUM_BYTES 8 \
  CONFIG.M_TUSER_WIDTH 16 \
  CONFIG.S_HAS_TKEEP 1 \
  CONFIG.S_TDATA_NUM_BYTES 8 \
  CONFIG.S_TUSER_WIDTH 16 \
  CONFIG.TDATA_REMAP {tdata[31:0],tdata[63:32]} \
  CONFIG.TKEEP_REMAP {tkeep[3:0],tkeep[7:4]} \
  CONFIG.TUSER_REMAP {tuser[7:0],tuser[15:8]} \
] [get_bd_cells axi_stream_sc_in]
create_bd_cell -type ip -vlnv xilinx.com:ip:axis_clock_converter:1.1 axi_stream_cc
set_property -dict {CONFIG.TUSER_WIDTH 16} [get_bd_cells axi_stream_cc]
create_bd_cell -type ip -vlnv xilinx.com:ip:axis_dwidth_converter:1.1 axi_stream_dwc
set_property -dict [list \
  CONFIG.M_TDATA_NUM_BYTES 4 \
  CONFIG.S_TDATA_NUM_BYTES 8 \
  CONFIG.TUSER_BITS_PER_BYTE 2 \
] [get_bd_cells axi_stream_dwc]
create_bd_cell -type ip -vlnv xilinx.com:ip:axis_subset_converter:1.1 axi_stream_cc_sc_out
set_property -dict [list \
  CONFIG.M_HAS_TREADY 0 \
  CONFIG.M_TDATA_NUM_BYTES 4 \
  CONFIG.M_TUSER_WIDTH 8 \
  CONFIG.S_TDATA_NUM_BYTES 4 \
  CONFIG.S_TUSER_WIDTH 8 \
  CONFIG.TDATA_REMAP {tdata[31:0]} \
] [get_bd_cells axi_stream_cc_sc_out]
create_bd_cell -type ip -vlnv xilinx.com:ip:xlconcat:2.1 xlconcat_0
create_bd_cell -type ip -vlnv xilinx.com:ip:xlconcat:2.1 xlconcat_1
set_property -dict {CONFIG.NUM_PORTS 4} [get_bd_cells xlconcat_1]
create_bd_cell -type ip -vlnv xilinx.com:ip:xlslice:1.0 bit0
set_property -dict {CONFIG.DIN_WIDTH 8} [get_bd_cells bit0]
create_bd_cell -type ip -vlnv xilinx.com:ip:xlslice:1.0 bit_6_to_3
set_property -dict {CONFIG.DIN_FROM 6 CONFIG.DIN_TO 3 CONFIG.DIN_WIDTH 8 CONFIG.DOUT_WIDTH 4} [get_bd_cells bit_6_to_3]
create_bd_cell -type ip -vlnv xilinx.com:ip:xlslice:1.0 bit_2_to_1
set_property -dict {CONFIG.DIN_FROM 2 CONFIG.DIN_TO 1 CONFIG.DIN_WIDTH 8 CONFIG.DOUT_WIDTH 2} [get_bd_cells bit_2_to_1]
create_bd_cell -type ip -vlnv xilinx.com:ip:xlconstant:1.1 xlconstant_0
set_property -dict {CONFIG.CONST_VAL 0} [get_bd_cells xlconstant_0]

# ---- hierarchy /Aurora/data_downconverter13 ----
current_bd_instance /Aurora/data_downconverter13
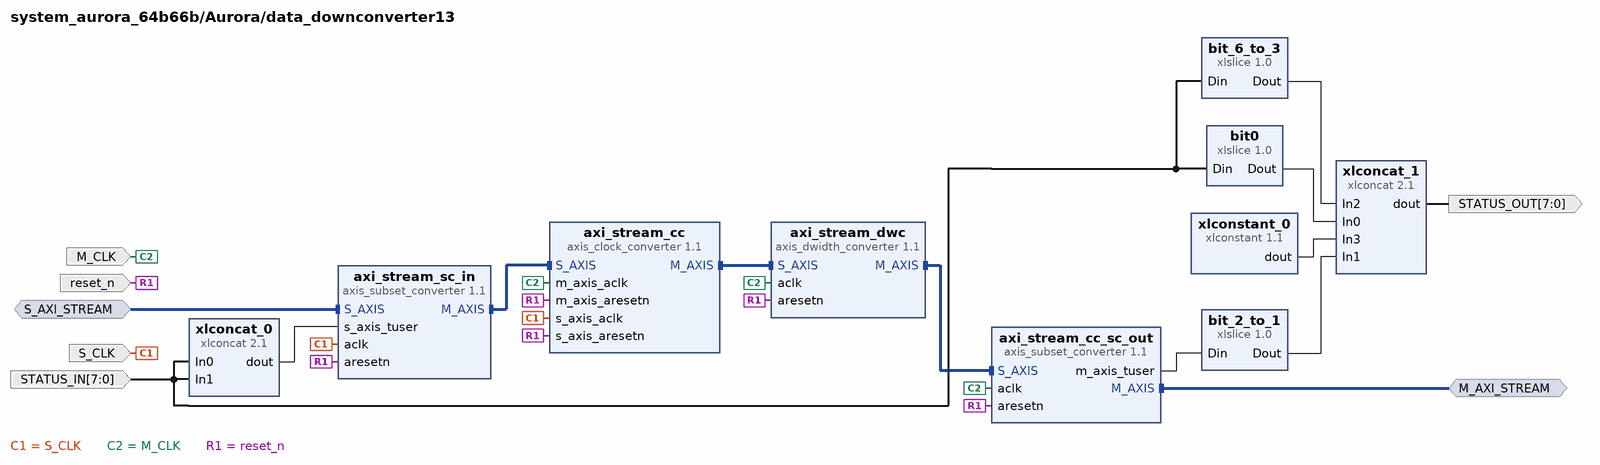
[diagram p9: block diagram inside /Aurora/data_downconverter13]
create_bd_intf_pin -mode Slave -vlnv xilinx.com:interface:axis_rtl:1.0 S_AXI_STREAM
create_bd_intf_pin -mode Master -vlnv xilinx.com:interface:axis_rtl:1.0 M_AXI_STREAM
create_bd_pin -dir I -type clk S_CLK
create_bd_pin -dir I -type clk M_CLK
create_bd_pin -dir I -type rst reset_n
create_bd_pin -dir I -from 7 -to 0 STATUS_IN
create_bd_pin -dir O -from 7 -to 0 STATUS_OUT

create_bd_cell -type ip -vlnv xilinx.com:ip:axis_subset_converter:1.1 axi_stream_sc_in
set_property -dict [list \
  CONFIG.M_HAS_TKEEP 1 \
  CONFIG.M_HAS_TREADY 1 \
  CONFIG.M_TDATA_NUM_BYTES 8 \
  CONFIG.M_TUSER_WIDTH 16 \
  CONFIG.S_HAS_TKEEP 1 \
  CONFIG.S_TDATA_NUM_BYTES 8 \
  CONFIG.S_TUSER_WIDTH 16 \
  CONFIG.TDATA_REMAP {tdata[31:0],tdata[63:32]} \
  CONFIG.TKEEP_REMAP {tkeep[3:0],tkeep[7:4]} \
  CONFIG.TUSER_REMAP {tuser[7:0],tuser[15:8]} \
] [get_bd_cells axi_stream_sc_in]
create_bd_cell -type ip -vlnv xilinx.com:ip:axis_clock_converter:1.1 axi_stream_cc
set_property -dict {CONFIG.TUSER_WIDTH 16} [get_bd_cells axi_stream_cc]
create_bd_cell -type ip -vlnv xilinx.com:ip:axis_dwidth_converter:1.1 axi_stream_dwc
set_property -dict [list \
  CONFIG.M_TDATA_NUM_BYTES 4 \
  CONFIG.S_TDATA_NUM_BYTES 8 \
  CONFIG.TUSER_BITS_PER_BYTE 2 \
] [get_bd_cells axi_stream_dwc]
create_bd_cell -type ip -vlnv xilinx.com:ip:axis_subset_converter:1.1 axi_stream_cc_sc_out
set_property -dict [list \
  CONFIG.M_HAS_TREADY 0 \
  CONFIG.M_TDATA_NUM_BYTES 4 \
  CONFIG.M_TUSER_WIDTH 8 \
  CONFIG.S_TDATA_NUM_BYTES 4 \
  CONFIG.S_TUSER_WIDTH 8 \
  CONFIG.TDATA_REMAP {tdata[31:0]} \
] [get_bd_cells axi_stream_cc_sc_out]
create_bd_cell -type ip -vlnv xilinx.com:ip:xlconcat:2.1 xlconcat_0
create_bd_cell -type ip -vlnv xilinx.com:ip:xlconcat:2.1 xlconcat_1
set_property -dict {CONFIG.NUM_PORTS 4} [get_bd_cells xlconcat_1]
create_bd_cell -type ip -vlnv xilinx.com:ip:xlslice:1.0 bit0
set_property -dict {CONFIG.DIN_WIDTH 8} [get_bd_cells bit0]
create_bd_cell -type ip -vlnv xilinx.com:ip:xlslice:1.0 bit_6_to_3
set_property -dict {CONFIG.DIN_FROM 6 CONFIG.DIN_TO 3 CONFIG.DIN_WIDTH 8 CONFIG.DOUT_WIDTH 4} [get_bd_cells bit_6_to_3]
create_bd_cell -type ip -vlnv xilinx.com:ip:xlslice:1.0 bit_2_to_1
set_property -dict {CONFIG.DIN_FROM 2 CONFIG.DIN_TO 1 CONFIG.DIN_WIDTH 8 CONFIG.DOUT_WIDTH 2} [get_bd_cells bit_2_to_1]
create_bd_cell -type ip -vlnv xilinx.com:ip:xlconstant:1.1 xlconstant_0
set_property -dict {CONFIG.CONST_VAL 0} [get_bd_cells xlconstant_0]

# ---- connections ----

current_bd_instance /microblaze_0_local_memory
connect_bd_intf_net [get_bd_intf_pins dlmb_bram_if_cntlr_bram/BRAM_PORTA] [get_bd_intf_pins dlmb_bram_if_cntlr/BRAM_PORT]
connect_bd_intf_net [get_bd_intf_pins dlmb_bram_if_cntlr_bram/BRAM_PORTB] [get_bd_intf_pins ilmb_bram_if_cntlr/BRAM_PORT]
connect_bd_intf_net [get_bd_intf_pins DLMB] [get_bd_intf_pins dlmb_v10/LMB_M]
connect_bd_intf_net [get_bd_intf_pins dlmb_v10/LMB_Sl_0] [get_bd_intf_pins dlmb_bram_if_cntlr/SLMB]
connect_bd_intf_net [get_bd_intf_pins ILMB] [get_bd_intf_pins ilmb_v10/LMB_M]
connect_bd_intf_net [get_bd_intf_pins ilmb_v10/LMB_Sl_0] [get_bd_intf_pins ilmb_bram_if_cntlr/SLMB]
connect_bd_net -net microblaze_0_Clk [get_bd_pins LMB_Clk] \
  [get_bd_pins dlmb_v10/LMB_Clk] [get_bd_pins ilmb_v10/LMB_Clk] [get_bd_pins dlmb_bram_if_cntlr/LMB_Clk] \
  [get_bd_pins ilmb_bram_if_cntlr/LMB_Clk]
connect_bd_net -net microblaze_0_LMB_Rst [get_bd_pins LMB_Rst] \
  [get_bd_pins dlmb_v10/SYS_Rst] [get_bd_pins ilmb_v10/SYS_Rst] [get_bd_pins dlmb_bram_if_cntlr/LMB_Rst] \
  [get_bd_pins ilmb_bram_if_cntlr/LMB_Rst]
set_property HDL_ATTRIBUTE.BMM_INFO_ADDRESS_SPACE {byte  0x00000000 32 > system_aurora_64b66b microblaze_0_local_memory/dlmb_bram_if_cntlr_bram} [get_bd_cells dlmb_bram_if_cntlr]
set_property HDL_ATTRIBUTE.KEEP_HIERARCHY yes [get_bd_cells dlmb_bram_if_cntlr]

current_bd_instance /Aurora
connect_bd_intf_net [get_bd_intf_pins S_AXI] [get_bd_intf_pins drp_bridge_0/S_AXI]
connect_bd_intf_net [get_bd_intf_pins GT_DIFF_REFCLK_125] [get_bd_intf_pins aurora_64b66b_0/GT_DIFF_REFCLK1]
connect_bd_intf_net [get_bd_intf_pins GT_SERIAL_RX1] [get_bd_intf_pins aurora_64b66b_1/GT_SERIAL_RX]
connect_bd_intf_net [get_bd_intf_pins GT_SERIAL_RX2] [get_bd_intf_pins aurora_64b66b_2/GT_SERIAL_RX]
connect_bd_intf_net [get_bd_intf_pins GT_SERIAL_RX3] [get_bd_intf_pins aurora_64b66b_3/GT_SERIAL_RX]
connect_bd_intf_net [get_bd_intf_pins GT_SERIAL_RX] [get_bd_intf_pins aurora_64b66b_0/GT_SERIAL_RX]
connect_bd_intf_net [get_bd_intf_pins GT_TEST_SERIAL_RX] [get_bd_intf_pins aurora_64b66b_4/GT_SERIAL_RX]
connect_bd_intf_net [get_bd_intf_pins data_downconverter12/S_AXI_STREAM] [get_bd_intf_pins aurora_64b66b_1/USER_DATA_M_AXIS_RX]
connect_bd_intf_net [get_bd_intf_pins data_downconverter10/S_AXI_STREAM] [get_bd_intf_pins aurora_64b66b_2/USER_DATA_M_AXIS_RX]
connect_bd_intf_net [get_bd_intf_pins TEST_DATA_S_AXI_TX] [get_bd_intf_pins data_upconverter3/S_AXI_STREAM]
connect_bd_intf_net [get_bd_intf_pins USER_DATA_S_AXI_TX2] [get_bd_intf_pins data_upconverter1/S_AXI_STREAM]
connect_bd_intf_net [get_bd_intf_pins USER_DATA_S_AXI_TX3] [get_bd_intf_pins data_upconverter2/S_AXI_STREAM]
connect_bd_intf_net [get_bd_intf_pins GT_SERIAL_TX] [get_bd_intf_pins aurora_64b66b_0/GT_SERIAL_TX]
connect_bd_intf_net [get_bd_intf_pins aurora_64b66b_0/USER_DATA_M_AXIS_RX] [get_bd_intf_pins data_downconverter13/S_AXI_STREAM]
connect_bd_intf_net [get_bd_intf_pins GT_SERIAL_TX3] [get_bd_intf_pins aurora_64b66b_3/GT_SERIAL_TX]
connect_bd_intf_net [get_bd_intf_pins GT_SERIAL_TX1] [get_bd_intf_pins aurora_64b66b_1/GT_SERIAL_TX]
connect_bd_intf_net [get_bd_intf_pins GT_SERIAL_TX2] [get_bd_intf_pins aurora_64b66b_2/GT_SERIAL_TX]
connect_bd_intf_net [get_bd_intf_pins aurora_64b66b_3/USER_DATA_M_AXIS_RX] [get_bd_intf_pins data_downconverter11/S_AXI_STREAM]
connect_bd_intf_net [get_bd_intf_pins GT_TEST_SERIAL_TX] [get_bd_intf_pins aurora_64b66b_4/GT_SERIAL_TX]
connect_bd_intf_net [get_bd_intf_pins USER_DATA_M_AXI_RX2] [get_bd_intf_pins data_downconverter10/M_AXI_STREAM]
connect_bd_intf_net [get_bd_intf_pins USER_DATA_M_AXI_RX3] [get_bd_intf_pins data_downconverter11/M_AXI_STREAM]
connect_bd_intf_net [get_bd_intf_pins USER_DATA_M_AXI_RX1] [get_bd_intf_pins data_downconverter12/M_AXI_STREAM]
connect_bd_intf_net [get_bd_intf_pins USER_DATA_M_AXI_RX] [get_bd_intf_pins data_downconverter13/M_AXI_STREAM]
connect_bd_intf_net [get_bd_intf_pins aurora_64b66b_2/USER_DATA_S_AXIS_TX] [get_bd_intf_pins data_upconverter1/M_AXI_STREAM]
connect_bd_intf_net [get_bd_intf_pins data_upconverter2/M_AXI_STREAM] [get_bd_intf_pins aurora_64b66b_3/USER_DATA_S_AXIS_TX]
connect_bd_intf_net [get_bd_intf_pins data_upconverter3/M_AXI_STREAM] [get_bd_intf_pins aurora_64b66b_4/USER_DATA_S_AXIS_TX]
connect_bd_intf_net [get_bd_intf_pins aurora_64b66b_0/CHANNEL_DRP_IF0] [get_bd_intf_pins drp_bridge_0/DRP0]
connect_bd_intf_net [get_bd_intf_pins drp_bridge_0/DRP1] [get_bd_intf_pins aurora_64b66b_1/CHANNEL_DRP_IF0]
connect_bd_intf_net [get_bd_intf_pins drp_bridge_0/DRP2] [get_bd_intf_pins aurora_64b66b_2/CHANNEL_DRP_IF0]
connect_bd_intf_net [get_bd_intf_pins aurora_64b66b_3/CHANNEL_DRP_IF0] [get_bd_intf_pins drp_bridge_0/DRP3]
connect_bd_intf_net [get_bd_intf_pins drp_bridge_0/DRP4] [get_bd_intf_pins aurora_64b66b_4/CHANNEL_DRP_IF0]
connect_bd_net [get_bd_pins AXI_aclk] \
  [get_bd_pins drp_bridge_0/AXI_aclk] [get_bd_pins aurora_64b66b_0/drp_clk_in] [get_bd_pins aurora_64b66b_3/drp_clk_in] \
  [get_bd_pins aurora_64b66b_4/drp_clk_in] [get_bd_pins aurora_64b66b_2/drp_clk_in] [get_bd_pins aurora_64b66b_1/drp_clk_in]
connect_bd_net [get_bd_pins AXI_aresetn] [get_bd_pins drp_bridge_0/AXI_aresetn]
connect_bd_net [get_bd_pins aurora_64b66b_0/channel_up] [get_bd_pins core_status3/In0]
connect_bd_net [get_bd_pins aurora_64b66b_0/crc_pass_fail_n] [get_bd_pins core_status3/In1]
connect_bd_net [get_bd_pins aurora_64b66b_0/crc_valid] [get_bd_pins core_status3/In2]
connect_bd_net [get_bd_pins aurora_64b66b_0/gt_pll_lock] [get_bd_pins core_status3/In3]
connect_bd_net [get_bd_pins aurora_64b66b_0/hard_err] [get_bd_pins core_status3/In4]
connect_bd_net [get_bd_pins aurora_64b66b_0/lane_up] [get_bd_pins core_status3/In5]
connect_bd_net [get_bd_pins aurora_64b66b_0/mmcm_not_locked_out] [get_bd_pins core_status3/In7]
connect_bd_net [get_bd_pins aurora_64b66b_0/soft_err] [get_bd_pins core_status3/In6]
connect_bd_net [get_bd_pins aurora_64b66b_1/channel_up] [get_bd_pins core_status/In0]
connect_bd_net [get_bd_pins aurora_64b66b_1/crc_pass_fail_n] [get_bd_pins core_status/In1]
connect_bd_net [get_bd_pins aurora_64b66b_1/crc_valid] [get_bd_pins core_status/In2]
connect_bd_net [get_bd_pins aurora_64b66b_1/gt_pll_lock] [get_bd_pins core_status/In3]
connect_bd_net [get_bd_pins aurora_64b66b_1/hard_err] [get_bd_pins core_status/In4]
connect_bd_net [get_bd_pins aurora_64b66b_1/lane_up] [get_bd_pins core_status/In5]
connect_bd_net [get_bd_pins aurora_64b66b_1/soft_err] [get_bd_pins core_status/In6]
connect_bd_net [get_bd_pins aurora_64b66b_2/channel_up] [get_bd_pins core_status1/In0]
connect_bd_net [get_bd_pins aurora_64b66b_2/crc_pass_fail_n] [get_bd_pins core_status1/In1]
connect_bd_net [get_bd_pins aurora_64b66b_2/crc_valid] [get_bd_pins core_status1/In2]
connect_bd_net [get_bd_pins aurora_64b66b_2/gt_pll_lock] [get_bd_pins core_status1/In3]
connect_bd_net [get_bd_pins aurora_64b66b_2/hard_err] [get_bd_pins core_status1/In4]
connect_bd_net [get_bd_pins aurora_64b66b_2/lane_up] [get_bd_pins core_status1/In5]
connect_bd_net [get_bd_pins aurora_64b66b_2/soft_err] [get_bd_pins core_status1/In6]
connect_bd_net [get_bd_pins aurora_64b66b_3/channel_up] [get_bd_pins core_status2/In0]
connect_bd_net [get_bd_pins aurora_64b66b_3/crc_pass_fail_n] [get_bd_pins core_status2/In1]
connect_bd_net [get_bd_pins aurora_64b66b_3/crc_valid] [get_bd_pins core_status2/In2]
connect_bd_net [get_bd_pins aurora_64b66b_3/gt_pll_lock] [get_bd_pins core_status2/In3]
connect_bd_net [get_bd_pins aurora_64b66b_3/hard_err] [get_bd_pins core_status2/In4]
connect_bd_net [get_bd_pins aurora_64b66b_3/lane_up] [get_bd_pins core_status2/In5]
connect_bd_net [get_bd_pins aurora_64b66b_3/soft_err] [get_bd_pins core_status2/In6]
connect_bd_net [get_bd_pins aurora_64b66b_4/channel_up] [get_bd_pins core_status4/In0]
connect_bd_net [get_bd_pins aurora_64b66b_4/crc_pass_fail_n] [get_bd_pins core_status4/In1]
connect_bd_net [get_bd_pins aurora_64b66b_4/crc_valid] [get_bd_pins core_status4/In2]
connect_bd_net [get_bd_pins aurora_64b66b_4/gt_pll_lock] [get_bd_pins core_status4/In3]
connect_bd_net [get_bd_pins aurora_64b66b_4/hard_err] [get_bd_pins core_status4/In4]
connect_bd_net [get_bd_pins aurora_64b66b_4/lane_up] [get_bd_pins core_status4/In5]
connect_bd_net [get_bd_pins aurora_64b66b_4/soft_err] [get_bd_pins core_status4/In6]
connect_bd_net -net aurora_8b10b_0_gt_refclk1_out [get_bd_pins aurora_64b66b_0/gt_refclk1_out] \
  [get_bd_pins auroraRefClk] [get_bd_pins aurora_64b66b_3/refclk1_in] [get_bd_pins aurora_64b66b_4/refclk1_in] \
  [get_bd_pins aurora_64b66b_2/refclk1_in] [get_bd_pins aurora_64b66b_1/refclk1_in]
connect_bd_net -net aurora_8b10b_0_gt_reset_out [get_bd_pins aurora_64b66b_0/gt_reset_out] \
  [get_bd_pins gtxResetOut] [get_bd_pins aurora_64b66b_3/pma_init] [get_bd_pins aurora_64b66b_4/pma_init] \
  [get_bd_pins aurora_64b66b_2/pma_init] [get_bd_pins aurora_64b66b_1/pma_init]
connect_bd_net -net aurora_8b10b_0_pll_not_locked_out [get_bd_pins util_vector_logic_1/Res] [get_bd_pins pll_not_locked_out]
connect_bd_net -net aurora_8b10b_0_sync_clk_out [get_bd_pins aurora_64b66b_0/sync_clk_out] \
  [get_bd_pins aurora_64b66b_3/sync_clk] [get_bd_pins aurora_64b66b_4/sync_clk] [get_bd_pins aurora_64b66b_2/sync_clk] \
  [get_bd_pins aurora_64b66b_1/sync_clk]
connect_bd_net -net aurora_8b10b_0_user_clk_out [get_bd_pins aurora_64b66b_0/user_clk_out] \
  [get_bd_pins aurora_64b66b_3/user_clk] [get_bd_pins aurora_64b66b_4/user_clk] [get_bd_pins aurora_64b66b_2/user_clk] \
  [get_bd_pins aurora_64b66b_1/user_clk] [get_bd_pins clk_wiz_0/clk_in1] [get_bd_pins data_upconverter1/M_CLK] \
  [get_bd_pins data_upconverter2/M_CLK] [get_bd_pins data_upconverter3/M_CLK] [get_bd_pins data_downconverter10/S_CLK] \
  [get_bd_pins data_downconverter11/S_CLK] [get_bd_pins data_downconverter12/S_CLK] [get_bd_pins data_downconverter13/S_CLK]
connect_bd_net [get_bd_pins clk_wiz_0/clk_out1] \
  [get_bd_pins user_clk_out] [get_bd_pins data_upconverter1/S_CLK] [get_bd_pins data_upconverter2/S_CLK] \
  [get_bd_pins data_upconverter3/S_CLK] [get_bd_pins data_downconverter10/M_CLK] [get_bd_pins data_downconverter11/M_CLK] \
  [get_bd_pins data_downconverter12/M_CLK] [get_bd_pins data_downconverter13/M_CLK]
connect_bd_net [get_bd_pins clk_wiz_0/locked] [get_bd_pins util_vector_logic_1/Op1]
connect_bd_net [get_bd_pins core_status1/dout] [get_bd_pins data_downconverter10/STATUS_IN]
connect_bd_net [get_bd_pins core_status2/dout] [get_bd_pins data_downconverter11/STATUS_IN]
connect_bd_net [get_bd_pins core_status3/dout] [get_bd_pins data_downconverter13/STATUS_IN]
connect_bd_net [get_bd_pins core_status4/dout] [get_bd_pins CORE_TEST_STATUS]
connect_bd_net [get_bd_pins core_status/dout] [get_bd_pins data_downconverter12/STATUS_IN]
connect_bd_net [get_bd_pins data_downconverter10/STATUS_OUT] [get_bd_pins CORE_STATUS2]
connect_bd_net [get_bd_pins data_downconverter11/STATUS_OUT] [get_bd_pins CORE_STATUS3]
connect_bd_net [get_bd_pins data_downconverter12/STATUS_OUT] [get_bd_pins CORE_STATUS1]
connect_bd_net [get_bd_pins data_downconverter13/STATUS_OUT] [get_bd_pins CORE_STATUS]
connect_bd_net -net gt_reset_1 [get_bd_pins gtxReset] [get_bd_pins aurora_64b66b_0/pma_init]
connect_bd_net [get_bd_pins init_clk_in] \
  [get_bd_pins aurora_64b66b_0/init_clk] [get_bd_pins aurora_64b66b_3/init_clk] [get_bd_pins aurora_64b66b_4/init_clk] \
  [get_bd_pins aurora_64b66b_2/init_clk] [get_bd_pins aurora_64b66b_1/init_clk]
connect_bd_net -net reset_1 [get_bd_pins auroraReset] \
  [get_bd_pins util_vector_logic_0/Op1] [get_bd_pins aurora_64b66b_0/reset_pb] [get_bd_pins aurora_64b66b_3/reset_pb] \
  [get_bd_pins aurora_64b66b_4/reset_pb] [get_bd_pins aurora_64b66b_2/reset_pb] [get_bd_pins aurora_64b66b_1/reset_pb]
connect_bd_net [get_bd_pins util_vector_logic_0/Res] \
  [get_bd_pins data_upconverter1/reset_n] [get_bd_pins data_upconverter2/reset_n] [get_bd_pins data_upconverter3/reset_n] \
  [get_bd_pins data_downconverter10/reset_n] [get_bd_pins data_downconverter11/reset_n] \
  [get_bd_pins data_downconverter12/reset_n] [get_bd_pins data_downconverter13/reset_n]
connect_bd_net -net xlconstant_0_dout [get_bd_pins xlconstant_one/dout] [get_bd_pins gt0_qplllock_out] [get_bd_pins gt0_qpllrefclklost_out]
connect_bd_net -net xlconstant_3_dout [get_bd_pins xlconstant_zero/dout] \
  [get_bd_pins aurora_64b66b_1/gt_qpllclk_quad2_in] [get_bd_pins aurora_64b66b_1/gt_qpllrefclk_quad2_in] \
  [get_bd_pins aurora_64b66b_2/gt_qpllclk_quad1_in] [get_bd_pins aurora_64b66b_2/gt_qpllrefclk_quad1_in] \
  [get_bd_pins aurora_64b66b_3/gt_qpllclk_quad1_in] [get_bd_pins aurora_64b66b_3/gt_qpllrefclk_quad1_in] \
  [get_bd_pins aurora_64b66b_4/gt_qpllclk_quad1_in] [get_bd_pins aurora_64b66b_4/gt_qpllrefclk_quad1_in]
connect_bd_net -net xlconstant_5_dout [get_bd_pins xlconstant_zero_0/dout] \
  [get_bd_pins core_status/In7] [get_bd_pins core_status1/In7] [get_bd_pins core_status2/In7] [get_bd_pins core_status4/In7]
